# Altium schematic sheet POWER.SchDoc
size A3; SheetNumber: 3; SheetTotal: 3
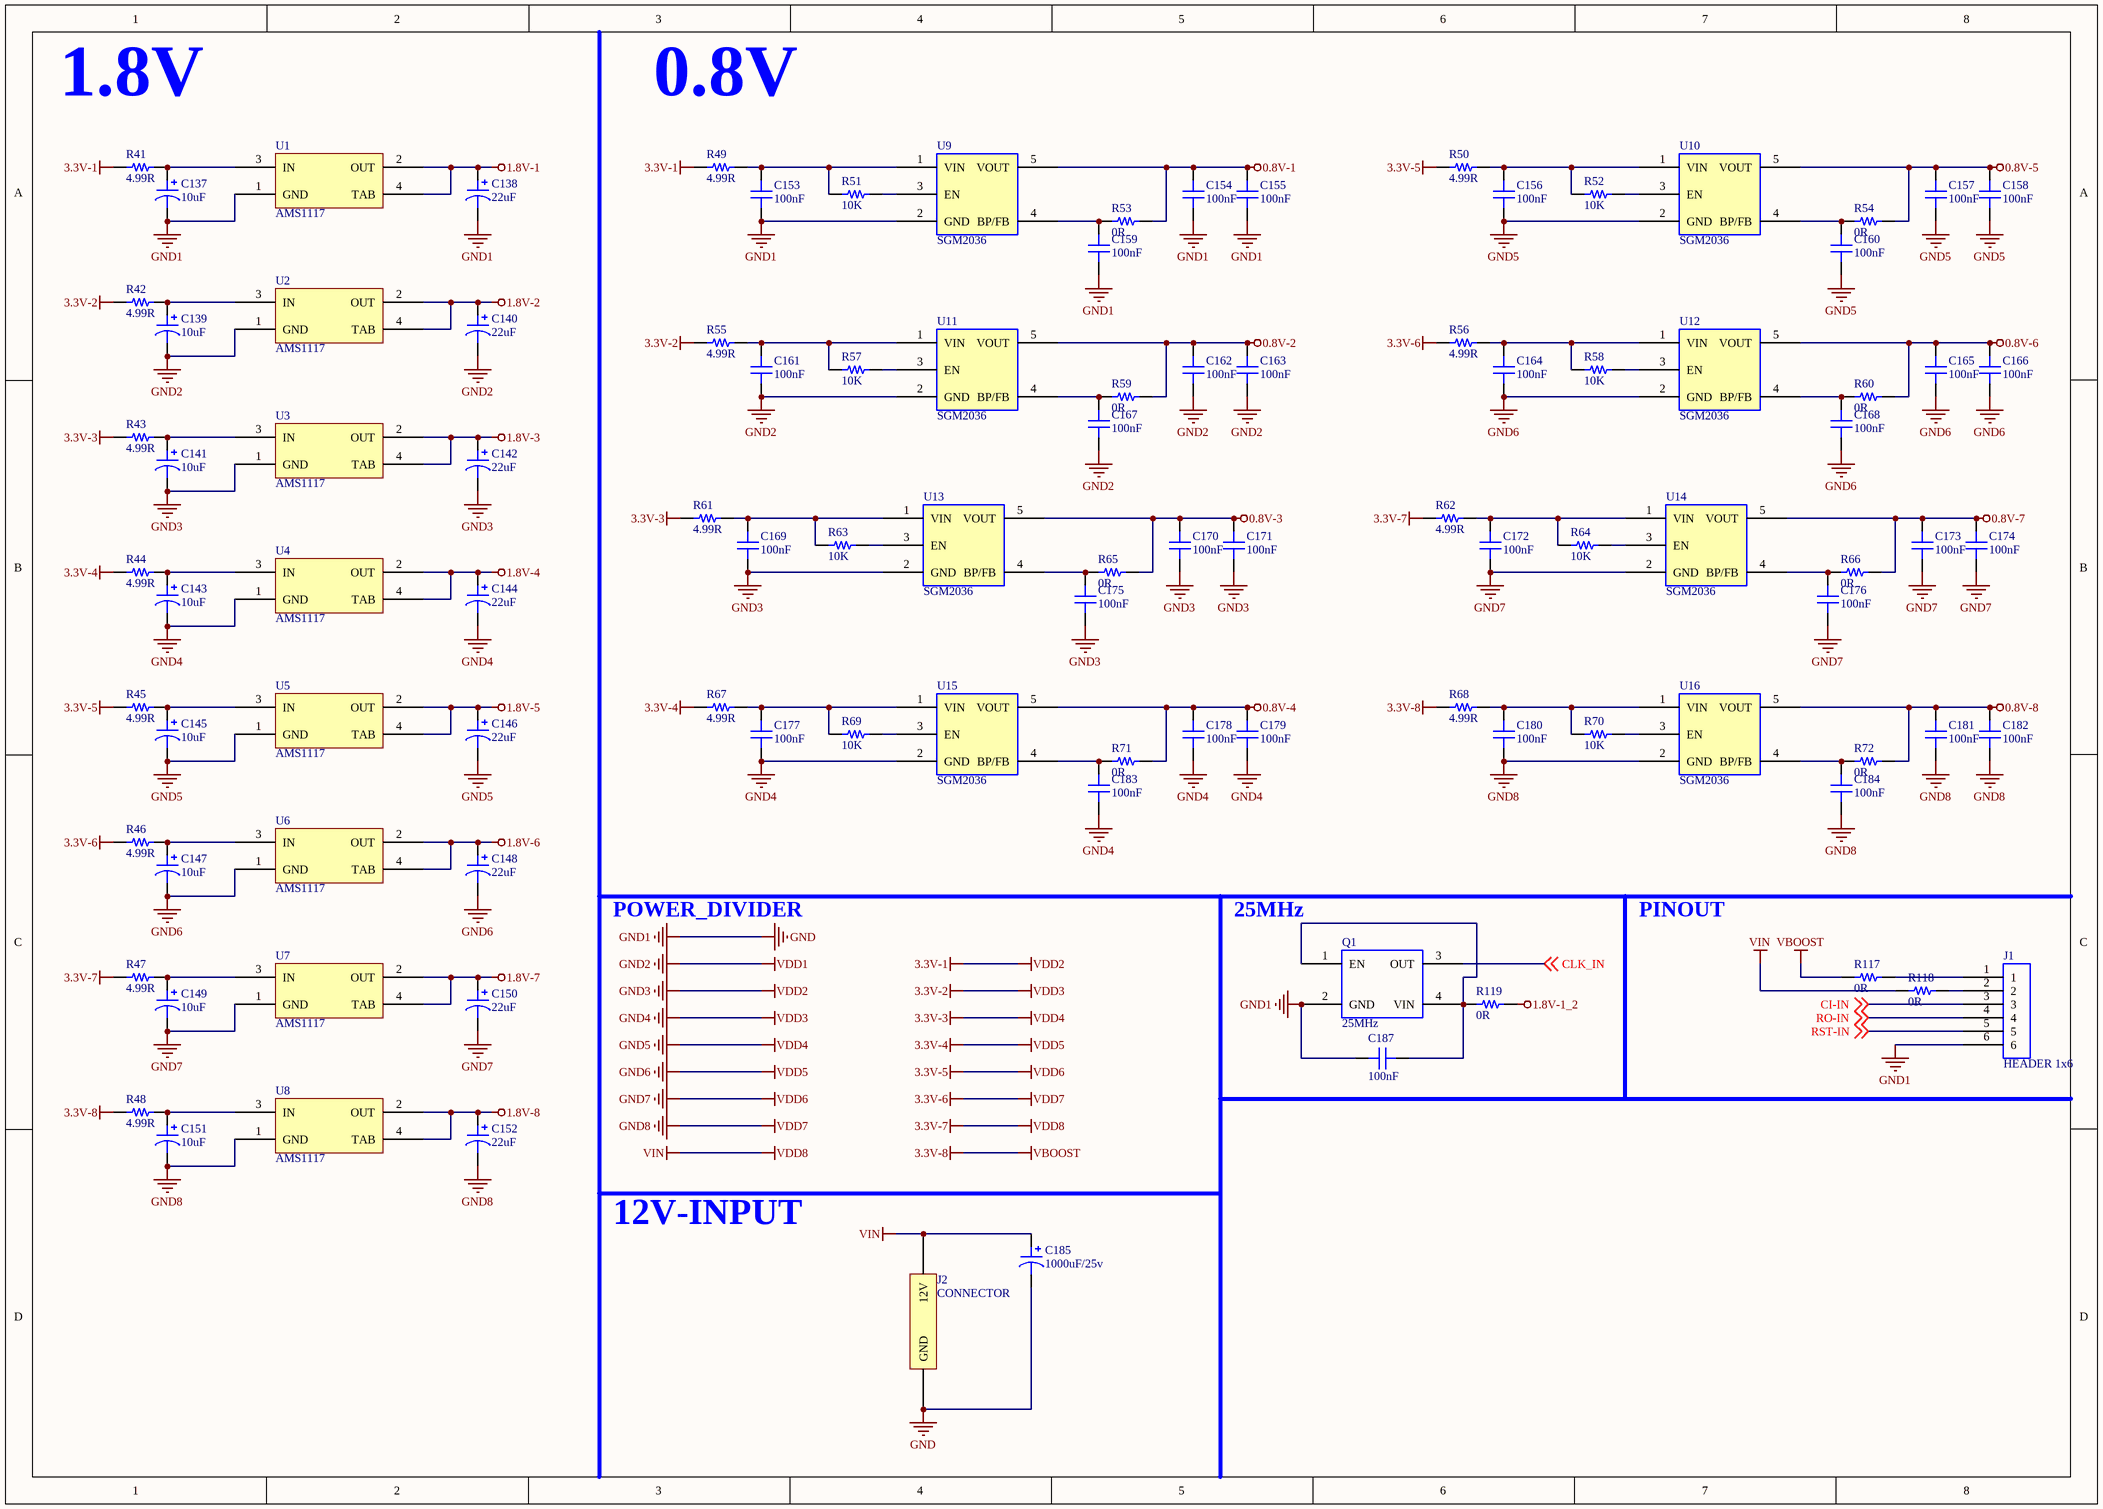
[diagram p0: POWER.SchDoc]

## Parts
C137  10uF  [CAP-TAN-CASE-A]
C138  22uF  [CAP-TAN-CASE-A]
C139  10uF  [CAP-TAN-CASE-A]
C140  22uF  [CAP-TAN-CASE-A]
C141  10uF  [CAP-TAN-CASE-A]
C142  22uF  [CAP-TAN-CASE-A]
C143  10uF  [CAP-TAN-CASE-A]
C144  22uF  [CAP-TAN-CASE-A]
C145  10uF  [CAP-TAN-CASE-A]
C146  22uF  [CAP-TAN-CASE-A]
C147  10uF  [CAP-TAN-CASE-A]
C148  22uF  [CAP-TAN-CASE-A]
C149  10uF  [CAP-TAN-CASE-A]
C150  22uF  [CAP-TAN-CASE-A]
C151  10uF  [CAP-TAN-CASE-A]
C152  22uF  [CAP-TAN-CASE-A]
C153  100nF  [CAP-SMD-0402]
C154  100nF  [CAP-SMD-0402]
C155  100nF  [CAP-SMD-0402]
C156  100nF  [CAP-SMD-0402]
C157  100nF  [CAP-SMD-0402]
C158  100nF  [CAP-SMD-0402]
C159  100nF  [CAP-SMD-0402]
C160  100nF  [CAP-SMD-0402]
C161  100nF  [CAP-SMD-0402]
C162  100nF  [CAP-SMD-0402]
C163  100nF  [CAP-SMD-0402]
C164  100nF  [CAP-SMD-0402]
C165  100nF  [CAP-SMD-0402]
C166  100nF  [CAP-SMD-0402]
C167  100nF  [CAP-SMD-0402]
C168  100nF  [CAP-SMD-0402]
C169  100nF  [CAP-SMD-0402]
C170  100nF  [CAP-SMD-0402]
C171  100nF  [CAP-SMD-0402]
C172  100nF  [CAP-SMD-0402]
C173  100nF  [CAP-SMD-0402]
C174  100nF  [CAP-SMD-0402]
C175  100nF  [CAP-SMD-0402]
C176  100nF  [CAP-SMD-0402]
C177  100nF  [CAP-SMD-0402]
C178  100nF  [CAP-SMD-0402]
C179  100nF  [CAP-SMD-0402]
C180  100nF  [CAP-SMD-0402]
C181  100nF  [CAP-SMD-0402]
C182  100nF  [CAP-SMD-0402]
C183  100nF  [CAP-SMD-0402]
C184  100nF  [CAP-SMD-0402]
C185  1000uF/25v  [CAP ALUM 10.3MM]
C187  100nF  [CAP-SMD-0603]
J1  HEADER 1x6  [HEADER-1x6]
J2  CONNECTOR  [ATX 6]
Q1  25MHz  [XTALL]
R41  4.99R  [RES-SMD-1206]
R42  4.99R  [RES-SMD-1206]
R43  4.99R  [RES-SMD-1206]
R44  4.99R  [RES-SMD-1206]
R45  4.99R  [RES-SMD-1206]
R46  4.99R  [RES-SMD-1206]
R47  4.99R  [RES-SMD-1206]
R48  4.99R  [RES-SMD-1206]
R49  4.99R  [RES-SMD-1206]
R50  4.99R  [RES-SMD-1206]
R51  10K  [RES-SMD-0402]
R52  10K  [RES-SMD-0402]
R53  0R  [RES-SMD-0402]
R54  0R  [RES-SMD-0402]
R55  4.99R  [RES-SMD-1206]
R56  4.99R  [RES-SMD-1206]
R57  10K  [RES-SMD-0402]
R58  10K  [RES-SMD-0402]
R59  0R  [RES-SMD-0402]
R60  0R  [RES-SMD-0402]
R61  4.99R  [RES-SMD-1206]
R62  4.99R  [RES-SMD-1206]
R63  10K  [RES-SMD-0402]
R64  10K  [RES-SMD-0402]
R65  0R  [RES-SMD-0402]
R66  0R  [RES-SMD-0402]
R67  4.99R  [RES-SMD-1206]
R68  4.99R  [RES-SMD-1206]
R69  10K  [RES-SMD-0402]
R70  10K  [RES-SMD-0402]
R71  0R  [RES-SMD-0402]
R72  0R  [RES-SMD-0402]
R117  0R  [RES]
R118  0R  [RES]
R119  0R  [RES]
U1  AMS1117  [AMS1117]
U2  AMS1117  [AMS1117]
U3  AMS1117  [AMS1117]
U4  AMS1117  [AMS1117]
U5  AMS1117  [AMS1117]
U6  AMS1117  [AMS1117]
U7  AMS1117  [AMS1117]
U8  AMS1117  [AMS1117]
U9  SGM2036  [SOT23-5PIN]
U10  SGM2036  [SOT23-5PIN]
U11  SGM2036  [SOT23-5PIN]
U12  SGM2036  [SOT23-5PIN]
U13  SGM2036  [SOT23-5PIN]
U14  SGM2036  [SOT23-5PIN]
U15  SGM2036  [SOT23-5PIN]
U16  SGM2036  [SOT23-5PIN]

## Nets
0.8V-1: C154.2 C155.2 R53.2 U9.5(VOUT)
0.8V-2: C162.2 C163.2 R59.2 U11.5(VOUT)
0.8V-3: C170.2 C171.2 R65.2 U13.5(VOUT)
0.8V-4: C178.2 C179.2 R71.2 U15.5(VOUT)
0.8V-5: C157.2 C158.2 R54.2 U10.5(VOUT)
0.8V-6: C165.2 C166.2 R60.2 U12.5(VOUT)
0.8V-7: C173.2 C174.2 R66.2 U14.5(VOUT)
0.8V-8: C181.2 C182.2 R72.2 U16.5(VOUT)
1.8V-1: C138.1 U1.2(OUT) U1.4(TAB)
1.8V-1_2: R119.2
1.8V-2: C140.1 U2.2(OUT) U2.4(TAB)
1.8V-3: C142.1 U3.2(OUT) U3.4(TAB)
1.8V-4: C144.1 U4.2(OUT) U4.4(TAB)
1.8V-5: C146.1 U5.2(OUT) U5.4(TAB)
1.8V-6: C148.1 U6.2(OUT) U6.4(TAB)
1.8V-7: C150.1 U7.2(OUT) U7.4(TAB)
1.8V-8: C152.1 U8.2(OUT) U8.4(TAB)
3.3V-1: C141.2 C142.2 C169.1 C170.1 C171.1 C175.1 R41.1 R49.1 U3.1(GND) U13.2(GND)  [also labelled GND3, VDD2]
3.3V-2: C143.2 C144.2 C177.1 C178.1 C179.1 C183.1 R42.1 R55.1 U4.1(GND) U15.2(GND)  [also labelled GND4, VDD3]
3.3V-3: C145.2 C146.2 C156.1 C157.1 C158.1 C160.1 R43.1 R61.1 U5.1(GND) U10.2(GND)  [also labelled GND5, VDD4]
3.3V-4: C147.2 C148.2 C164.1 C165.1 C166.1 C168.1 R44.1 R67.1 U6.1(GND) U12.2(GND)  [also labelled GND6, VDD5]
3.3V-5: C149.2 C150.2 C172.1 C173.1 C174.1 C176.1 R45.1 R50.1 U7.1(GND) U14.2(GND)  [also labelled GND7, VDD6]
3.3V-6: C151.2 C152.2 C180.1 C181.1 C182.1 C184.1 R46.1 R56.1 U8.1(GND) U16.2(GND)  [also labelled GND8, VDD7]
3.3V-7: C185.1 J2.2(12V) R47.1 R62.1 R118.1  [also labelled VDD8, VIN]
3.3V-8: R48.1 R68.1 R117.1  [also labelled VBOOST]
GND: C137.2 C138.2 C153.1 C154.1 C155.1 C159.1 C185.2 C187.2 J1.6 J2.1(GND) Q1.2(GND) U1.1(GND) U9.2(GND)  [also labelled GND1]
GND2: C139.2 C140.2 C161.1 C162.1 C163.1 C167.1 U2.1(GND) U11.2(GND)  [also labelled VDD1]
CI-IN: J1.3 ; off-sheet CI-IN
CLK_IN: Q1.3(OUT) ; off-sheet CLK_IN
RO-IN: J1.4 ; off-sheet RO-IN
RST-IN: J1.5 ; off-sheet RST-IN
NetC137_1: C137.1 R41.2 U1.3(IN)
NetC139_1: C139.1 R42.2 U2.3(IN)
NetC141_1: C141.1 R43.2 U3.3(IN)
NetC143_1: C143.1 R44.2 U4.3(IN)
NetC145_1: C145.1 R45.2 U5.3(IN)
NetC147_1: C147.1 R46.2 U6.3(IN)
NetC149_1: C149.1 R47.2 U7.3(IN)
NetC151_1: C151.1 R48.2 U8.3(IN)
NetC153_2: C153.2 R49.2 R51.1 U9.1(VIN)
NetC156_2: C156.2 R50.2 R52.1 U10.1(VIN)
NetC159_2: C159.2 R53.1 U9.4(BP/FB)
NetC160_2: C160.2 R54.1 U10.4(BP/FB)
NetC161_2: C161.2 R55.2 R57.1 U11.1(VIN)
NetC164_2: C164.2 R56.2 R58.1 U12.1(VIN)
NetC167_2: C167.2 R59.1 U11.4(BP/FB)
NetC168_2: C168.2 R60.1 U12.4(BP/FB)
NetC169_2: C169.2 R61.2 R63.1 U13.1(VIN)
NetC172_2: C172.2 R62.2 R64.1 U14.1(VIN)
NetC175_2: C175.2 R65.1 U13.4(BP/FB)
NetC176_2: C176.2 R66.1 U14.4(BP/FB)
NetC177_2: C177.2 R67.2 R69.1 U15.1(VIN)
NetC180_2: C180.2 R68.2 R70.1 U16.1(VIN)
NetC183_2: C183.2 R71.1 U15.4(BP/FB)
NetC184_2: C184.2 R72.1 U16.4(BP/FB)
NetC187_1: C187.1 Q1.1(EN) Q1.4(VIN) R119.1
NetJ1_1: J1.1 R117.2
NetJ1_2: J1.2 R118.2
NetR51_2: R51.2 U9.3(EN)
NetR52_2: R52.2 U10.3(EN)
NetR57_2: R57.2 U11.3(EN)
NetR58_2: R58.2 U12.3(EN)
NetR63_2: R63.2 U13.3(EN)
NetR64_2: R64.2 U14.3(EN)
NetR69_2: R69.2 U15.3(EN)
NetR70_2: R70.2 U16.3(EN)

## Notes on the sheet
- 1.8V
- 0.8V
- POWER_DIVIDER
- 25MHz
- PINOUT
- 12V-INPUT

## Library data of the parts
C137-C152 C185 = POLARIZED CAP
C153-C184 C187 = CAP
J2 = ATX 6
Q1 = OSCILLATOR
R41-R72 R117-R119 = RES